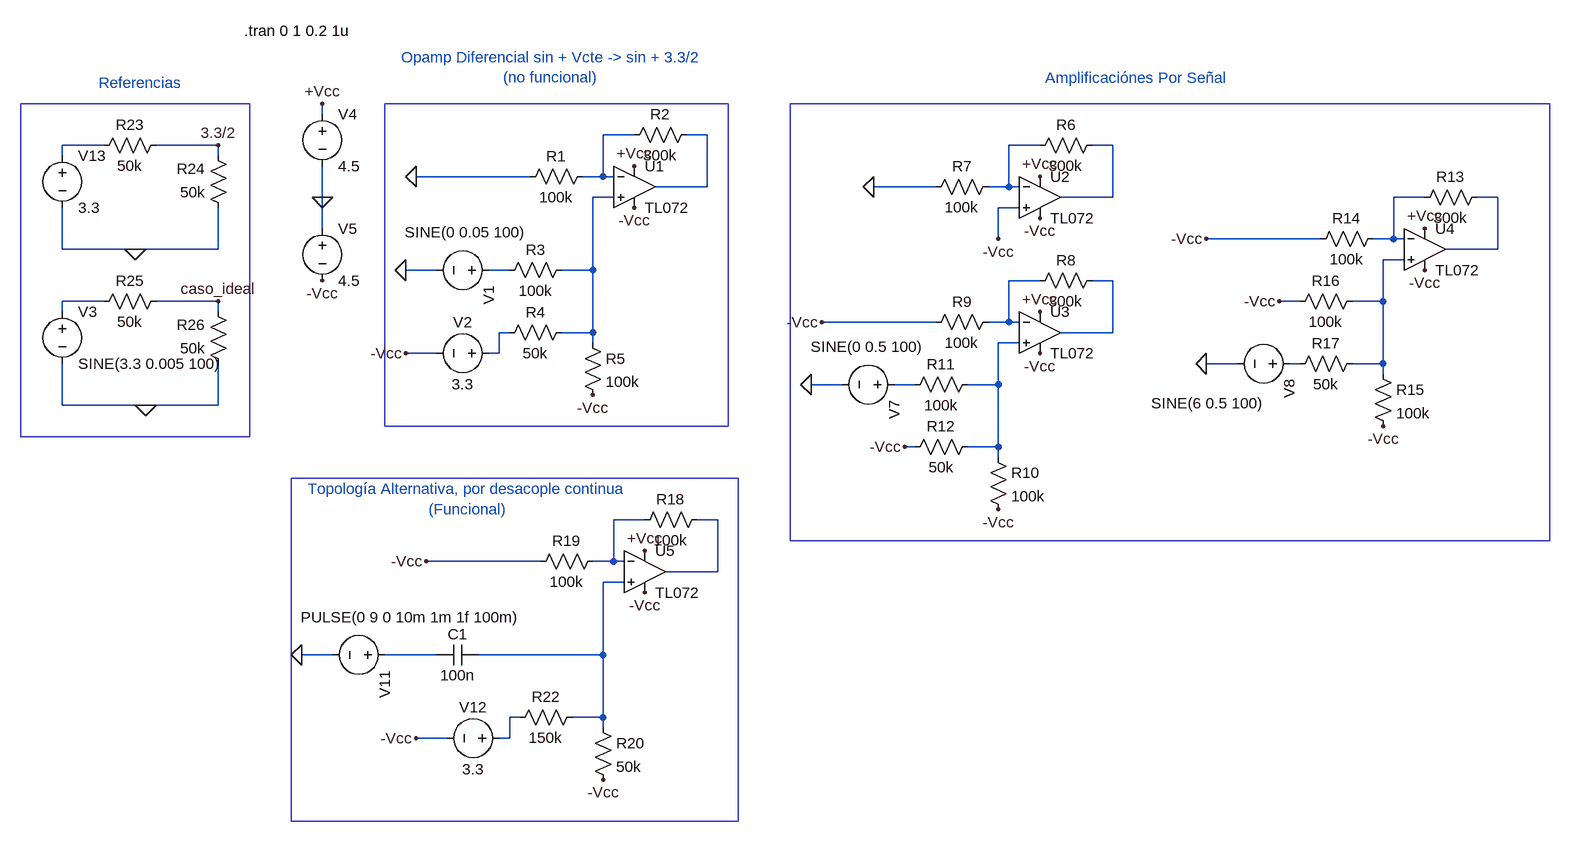
[diagram p0: schematic Amplificador_Diferencial_Spice.asc]
Amplificador_Diferencial_Spice.asc, the LTspice schematic file:
Version 4
SHEET 1 1636 1076
WIRE -256 -48 -256 -64
WIRE 224 -16 176 -16
WIRE 336 -16 304 -16
WIRE -592 0 -656 0
WIRE -416 0 -512 0
WIRE 848 0 800 0
WIRE 960 0 928 0
WIRE -656 16 -656 0
WIRE -416 16 -416 0
WIRE 64 48 -112 48
WIRE 176 48 176 -16
WIRE 176 48 144 48
WIRE 192 48 176 48
WIRE 336 64 336 -16
WIRE 336 64 256 64
WIRE 688 64 592 64
WIRE 800 64 800 0
WIRE 800 64 768 64
WIRE 816 64 800 64
WIRE -256 80 -256 32
WIRE 192 80 160 80
WIRE 960 80 960 0
WIRE 960 80 880 80
WIRE 1440 80 1392 80
WIRE 1552 80 1520 80
WIRE 816 96 784 96
WIRE -256 128 -256 80
WIRE 784 144 784 96
WIRE 1280 144 1104 144
WIRE 1392 144 1392 80
WIRE 1392 144 1360 144
WIRE 1408 144 1392 144
WIRE -656 160 -656 96
WIRE -544 160 -656 160
WIRE -416 160 -416 96
WIRE -416 160 -544 160
WIRE 1552 160 1552 80
WIRE 1552 160 1472 160
WIRE 1408 176 1376 176
WIRE -80 192 -128 192
WIRE 32 192 0 192
WIRE 160 192 160 80
WIRE 160 192 112 192
WIRE 848 208 800 208
WIRE 960 208 928 208
WIRE -592 240 -656 240
WIRE -416 240 -512 240
WIRE 1248 240 1216 240
WIRE 1376 240 1376 176
WIRE 1376 240 1328 240
WIRE -656 256 -656 240
WIRE -416 256 -416 240
WIRE 688 272 512 272
WIRE 800 272 800 208
WIRE 800 272 768 272
WIRE 816 272 800 272
WIRE 32 288 16 288
WIRE 160 288 160 192
WIRE 160 288 112 288
WIRE 960 288 960 208
WIRE 960 288 880 288
WIRE 160 304 160 288
WIRE 816 304 784 304
WIRE -80 320 -128 320
WIRE 16 320 16 288
WIRE 16 320 0 320
WIRE 1152 336 1104 336
WIRE 1248 336 1232 336
WIRE 1376 336 1376 240
WIRE 1376 336 1328 336
WIRE 1376 352 1376 336
WIRE 544 368 496 368
WIRE 656 368 624 368
WIRE 784 368 784 304
WIRE 784 368 736 368
WIRE -656 400 -656 336
WIRE -528 400 -656 400
WIRE -416 400 -416 336
WIRE -416 400 -528 400
WIRE 656 464 640 464
WIRE 784 464 784 368
WIRE 784 464 736 464
WIRE 784 480 784 464
WIRE 240 576 192 576
WIRE 352 576 320 576
WIRE 80 640 -96 640
WIRE 192 640 192 576
WIRE 192 640 160 640
WIRE 208 640 192 640
WIRE 352 656 352 576
WIRE 352 656 272 656
WIRE 208 672 176 672
WIRE -240 784 -288 784
WIRE -80 784 -160 784
WIRE 176 784 176 672
WIRE 176 784 -16 784
WIRE 48 880 32 880
WIRE 176 880 176 784
WIRE 176 880 128 880
WIRE 176 896 176 880
WIRE -64 912 -112 912
WIRE 32 912 32 880
WIRE 32 912 16 912
FLAG 224 96 -Vcc
FLAG 224 32 +Vcc
FLAG -256 -64 +Vcc
FLAG -256 208 -Vcc
FLAG 592 64 0
FLAG 848 112 -Vcc
FLAG 848 48 +Vcc
FLAG 848 320 -Vcc
FLAG 848 256 +Vcc
FLAG 240 688 -Vcc
FLAG 240 624 +Vcc
FLAG -416 0 3.3/2
FLAG 1440 192 -Vcc
FLAG 1440 128 +Vcc
FLAG 1104 336 0
FLAG -256 80 0
FLAG -112 48 0
FLAG -128 192 0
FLAG -128 320 -Vcc
FLAG 160 384 -Vcc
FLAG -96 640 -Vcc
FLAG -112 912 -Vcc
FLAG 176 976 -Vcc
FLAG -288 784 0
FLAG 784 144 -Vcc
FLAG 640 464 -Vcc
FLAG 784 560 -Vcc
FLAG 512 272 -Vcc
FLAG 496 368 0
FLAG 1216 240 -Vcc
FLAG 1104 144 -Vcc
FLAG 1376 432 -Vcc
FLAG -528 400 0
FLAG -416 240 caso_ideal
FLAG -544 160 0
SYMBOL voltage 16 192 R90
WINDOW 3 -58 145 VLeft 2
WINDOW 123 0 0 Left 0
WINDOW 39 0 0 Left 0
SYMATTR Value SINE(0 0.05 100)
SYMATTR InstName V1
SYMBOL voltage 16 320 R90
WINDOW 0 -32 56 VBottom 2
WINDOW 3 32 56 VTop 2
WINDOW 123 0 0 Left 0
WINDOW 39 0 0 Left 0
SYMATTR InstName V2
SYMATTR Value 3.3
SYMBOL OpAmps\\TL072 224 0 R0
SYMATTR InstName U1
SYMBOL res 320 -32 R90
WINDOW 0 0 56 VBottom 2
WINDOW 3 32 56 VTop 2
SYMATTR InstName R2
SYMATTR Value 300k
SYMBOL res 160 32 R90
WINDOW 0 0 56 VBottom 2
WINDOW 3 32 56 VTop 2
SYMATTR InstName R1
SYMATTR Value 100k
SYMBOL voltage -256 -64 R0
WINDOW 123 0 0 Left 0
WINDOW 39 0 0 Left 0
SYMATTR InstName V4
SYMATTR Value 4.5
SYMBOL voltage -256 112 R0
WINDOW 123 0 0 Left 0
WINDOW 39 0 0 Left 0
SYMATTR InstName V5
SYMATTR Value 4.5
SYMBOL res 144 288 R0
SYMATTR InstName R5
SYMATTR Value 100k
SYMBOL res 128 176 R90
WINDOW 0 0 56 VBottom 2
WINDOW 3 32 56 VTop 2
SYMATTR InstName R3
SYMATTR Value 100k
SYMBOL res 128 272 R90
WINDOW 0 0 56 VBottom 2
WINDOW 3 32 56 VTop 2
SYMATTR InstName R4
SYMATTR Value 50k
SYMBOL OpAmps\\TL072 848 16 R0
SYMATTR InstName U2
SYMBOL res 944 -16 R90
WINDOW 0 0 56 VBottom 2
WINDOW 3 32 56 VTop 2
SYMATTR InstName R6
SYMATTR Value 300k
SYMBOL res 784 48 R90
WINDOW 0 0 56 VBottom 2
WINDOW 3 32 56 VTop 2
SYMATTR InstName R7
SYMATTR Value 100k
SYMBOL OpAmps\\TL072 848 224 R0
SYMATTR InstName U3
SYMBOL res 944 192 R90
WINDOW 0 0 56 VBottom 2
WINDOW 3 32 56 VTop 2
SYMATTR InstName R8
SYMATTR Value 300k
SYMBOL res 784 256 R90
WINDOW 0 0 56 VBottom 2
WINDOW 3 32 56 VTop 2
SYMATTR InstName R9
SYMATTR Value 100k
SYMBOL voltage 640 368 R90
WINDOW 3 -58 145 VLeft 2
WINDOW 123 0 0 Left 0
WINDOW 39 0 0 Left 0
SYMATTR Value SINE(0 0.5 100)
SYMATTR InstName V7
SYMBOL res 768 464 R0
SYMATTR InstName R10
SYMATTR Value 100k
SYMBOL res 752 352 R90
WINDOW 0 0 56 VBottom 2
WINDOW 3 32 56 VTop 2
SYMATTR InstName R11
SYMATTR Value 100k
SYMBOL res 752 448 R90
WINDOW 0 0 56 VBottom 2
WINDOW 3 32 56 VTop 2
SYMATTR InstName R12
SYMATTR Value 50k
SYMBOL voltage -144 784 R90
WINDOW 3 -58 145 VLeft 2
WINDOW 123 0 0 Left 0
WINDOW 39 0 0 Left 0
SYMATTR Value PULSE(0 9 0 10m 1m 1f 100m)
SYMATTR InstName V11
SYMBOL voltage 32 912 R90
WINDOW 0 -32 56 VBottom 2
WINDOW 3 32 56 VTop 2
WINDOW 123 0 0 Left 0
WINDOW 39 0 0 Left 0
SYMATTR InstName V12
SYMATTR Value 3.3
SYMBOL OpAmps\\TL072 240 592 R0
SYMATTR InstName U5
SYMBOL res 336 560 R90
WINDOW 0 0 56 VBottom 2
WINDOW 3 32 56 VTop 2
SYMATTR InstName R18
SYMATTR Value 100k
SYMBOL res 176 624 R90
WINDOW 0 0 56 VBottom 2
WINDOW 3 32 56 VTop 2
SYMATTR InstName R19
SYMATTR Value 100k
SYMBOL res 160 880 R0
SYMATTR InstName R20
SYMATTR Value 50k
SYMBOL res 144 864 R90
WINDOW 0 0 56 VBottom 2
WINDOW 3 32 56 VTop 2
SYMATTR InstName R22
SYMATTR Value 150k
SYMBOL cap -16 768 R90
WINDOW 0 0 32 VBottom 2
WINDOW 3 32 32 VTop 2
SYMATTR InstName C1
SYMATTR Value 100n
SYMBOL voltage -656 0 R0
WINDOW 123 0 0 Left 0
WINDOW 39 0 0 Left 0
SYMATTR InstName V13
SYMATTR Value 3.3
SYMBOL res -496 -16 R90
WINDOW 0 0 56 VBottom 2
WINDOW 3 32 56 VTop 2
SYMATTR InstName R23
SYMATTR Value 50k
SYMBOL res -400 112 R180
WINDOW 0 36 76 Left 2
WINDOW 3 36 40 Left 2
SYMATTR InstName R24
SYMATTR Value 50k
SYMBOL OpAmps\\TL072 1440 96 R0
SYMATTR InstName U4
SYMBOL res 1536 64 R90
WINDOW 0 0 56 VBottom 2
WINDOW 3 32 56 VTop 2
SYMATTR InstName R13
SYMATTR Value 300k
SYMBOL res 1376 128 R90
WINDOW 0 0 56 VBottom 2
WINDOW 3 32 56 VTop 2
SYMATTR InstName R14
SYMATTR Value 100k
SYMBOL voltage 1248 336 R90
WINDOW 3 61 229 VLeft 2
WINDOW 123 0 0 Left 0
WINDOW 39 0 0 Left 0
SYMATTR Value SINE(6 0.5 100)
SYMATTR InstName V8
SYMBOL res 1360 336 R0
SYMATTR InstName R15
SYMATTR Value 100k
SYMBOL res 1344 224 R90
WINDOW 0 0 56 VBottom 2
WINDOW 3 32 56 VTop 2
SYMATTR InstName R16
SYMATTR Value 100k
SYMBOL res 1344 320 R90
WINDOW 0 0 56 VBottom 2
WINDOW 3 32 56 VTop 2
SYMATTR InstName R17
SYMATTR Value 50k
SYMBOL voltage -656 240 R0
WINDOW 123 0 0 Left 0
WINDOW 39 0 0 Left 0
SYMATTR InstName V3
SYMATTR Value SINE(3.3 0.005 100)
SYMBOL res -496 224 R90
WINDOW 0 0 56 VBottom 2
WINDOW 3 32 56 VTop 2
SYMATTR InstName R25
SYMATTR Value 50k
SYMBOL res -400 352 R180
WINDOW 0 36 76 Left 2
WINDOW 3 36 40 Left 2
SYMATTR InstName R26
SYMATTR Value 50k
TEXT -376 -176 Left 2 !.tran 0 1 0.2 1u
TEXT -600 -96 Left 2 ;Referencias
TEXT 96 -120 Center 2 ;Opamp Diferencial sin + Vcte -> sin + 3.3/2\n(no funcional)
TEXT 856 -104 Left 2 ;Amplificaciónes Por Señal
TEXT -32 544 Center 2 ;Topología Alternativa, por desacople continua\n(Funcional)
RECTANGLE Normal 368 432 -160 -64
RECTANGLE Normal 1632 608 464 -64
RECTANGLE Normal 384 1040 -304 512
RECTANGLE Normal -368 448 -720 -64

The netlist it stands for:
* Amplificador_Diferencial_Spice.asc
V1 N010 0 SINE(0 0.05 100)
V2 N014 -Vcc 3.3
XU1 N006 N001 +Vcc -Vcc N002 TL072  ; pins In+ In- V+ V- OUT
R2 N002 N001 300k
R1 N001 0 100k
V4 +Vcc 0 4.5
V5 0 -Vcc 4.5
R5 N006 -Vcc 100k
R3 N006 N010 100k
R4 N006 N014 50k
XU2 -Vcc N004 +Vcc -Vcc N005 TL072  ; pins In+ In- V+ V- OUT
R6 N005 N004 300k
R7 N004 0 100k
XU3 N015 N011 +Vcc -Vcc N012 TL072  ; pins In+ In- V+ V- OUT
R8 N012 N011 300k
R9 N011 -Vcc 100k
V7 N017 0 SINE(0 0.5 100)
R10 N015 -Vcc 100k
R11 N015 N017 100k
R12 N015 -Vcc 50k
V11 N021 0 PULSE(0 9 0 10m 1m 1f 100m)
V12 N022 -Vcc 3.3
XU5 N020 N018 +Vcc -Vcc N019 TL072  ; pins In+ In- V+ V- OUT
R18 N019 N018 100k
R19 N018 -Vcc 100k
R20 N020 -Vcc 50k
R22 N020 N022 150k
C1 N020 N021 100n
V13 N003 0 3.3
R23 3.3/2 N003 50k
R24 0 3.3/2 50k
XU4 N009 N007 +Vcc -Vcc N008 TL072  ; pins In+ In- V+ V- OUT
R13 N008 N007 300k
R14 N007 -Vcc 100k
V8 N016 0 SINE(6 0.5 100)
R15 N009 -Vcc 100k
R16 N009 -Vcc 100k
R17 N009 N016 50k
V3 N013 0 SINE(3.3 0.005 100)
R25 caso_ideal N013 50k
R26 0 caso_ideal 50k
.tran 0 1 0.2 1u
* Referencias
* Opamp Diferencial sin + Vcte -> sin + 3.3/2
* (no funcional)
* Amplificaciónes Por Señal
* Topología Alternativa, por desacople continua
* (Funcional)
.backanno
.end